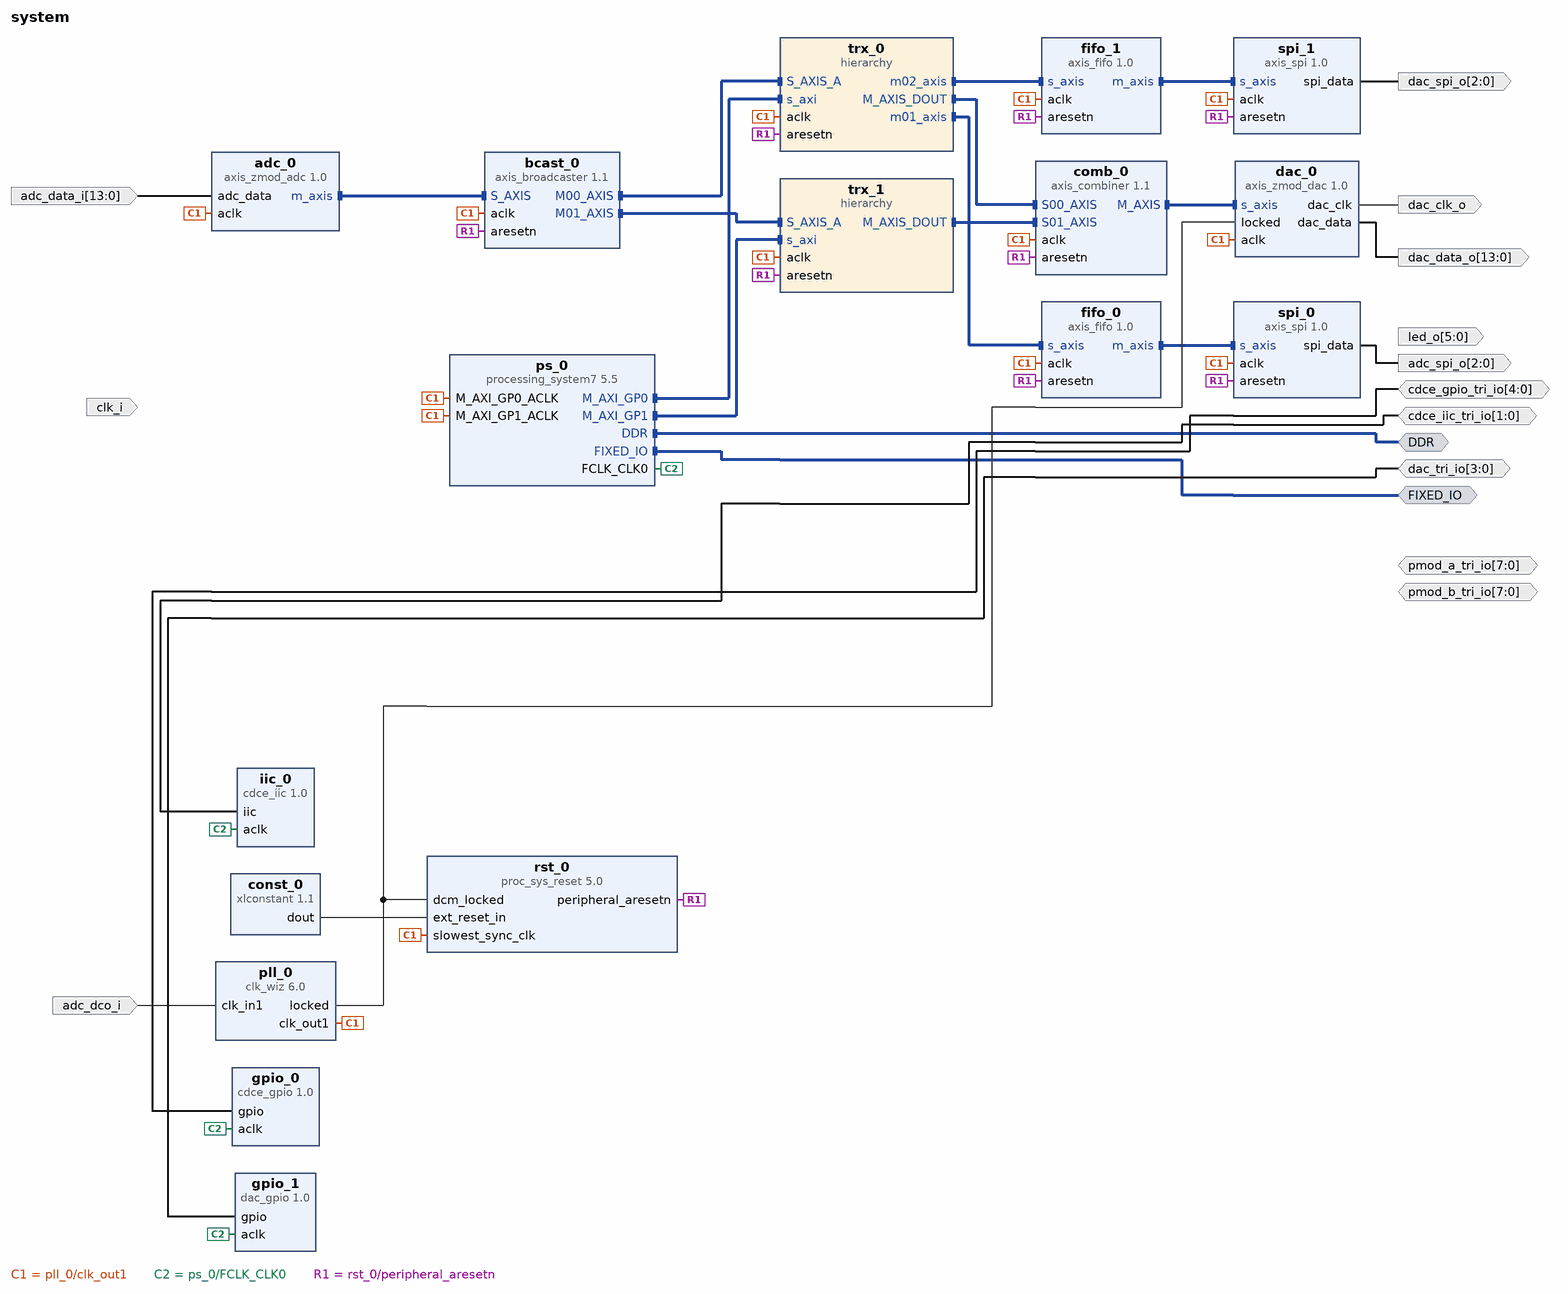
[diagram p0: block diagram of the top level]
# Vivado block design system, xc7z020clg484-1, Vivado 2024.2
create_bd_design system

create_bd_intf_port -mode Master -vlnv xilinx.com:interface:ddrx_rtl:1.0 DDR
create_bd_intf_port -mode Master -vlnv xilinx.com:display_processing_system7:fixedio_rtl:1.0 FIXED_IO
create_bd_port -dir I clk_i
create_bd_port -dir O -from 5 -to 0 led_o
create_bd_port -dir IO -from 7 -to 0 pmod_a_tri_io
create_bd_port -dir IO -from 7 -to 0 pmod_b_tri_io
create_bd_port -dir I -from 13 -to 0 adc_data_i
create_bd_port -dir I adc_dco_i
create_bd_port -dir O -from 2 -to 0 adc_spi_o
create_bd_port -dir IO -from 4 -to 0 cdce_gpio_tri_io
create_bd_port -dir IO -from 1 -to 0 cdce_iic_tri_io
create_bd_port -dir O -from 13 -to 0 dac_data_o
create_bd_port -dir O dac_clk_o
create_bd_port -dir O -from 2 -to 0 dac_spi_o
create_bd_port -dir IO -from 3 -to 0 dac_tri_io

create_bd_cell -type ip -vlnv xilinx.com:ip:clk_wiz:6.0 pll_0
set_property -dict [list \
  CONFIG.CLKIN1_UI_JITTER 600 \
  CONFIG.CLKOUT1_REQUESTED_OUT_FREQ 122.88 \
  CONFIG.CLKOUT1_USED true \
  CONFIG.JITTER_OPTIONS PS \
  CONFIG.JITTER_SEL Min_O_Jitter \
  CONFIG.PRIMITIVE PLL \
  CONFIG.PRIM_IN_FREQ 122.88 \
  CONFIG.USE_RESET false \
] [get_bd_cells pll_0]
create_bd_cell -type ip -vlnv xilinx.com:ip:processing_system7:5.5 ps_0
set_property -dict [list \
  CONFIG.PCW_APU_PERIPHERAL_FREQMHZ 666.666666 \
  CONFIG.PCW_ENET0_ENET0_IO {MIO 16 .. 27} \
  CONFIG.PCW_ENET0_GRP_MDIO_ENABLE 1 \
  CONFIG.PCW_ENET0_GRP_MDIO_IO {MIO 52 .. 53} \
  CONFIG.PCW_ENET0_PERIPHERAL_ENABLE 1 \
  CONFIG.PCW_ENET0_RESET_ENABLE 1 \
  CONFIG.PCW_ENET0_RESET_IO {MIO 9} \
  CONFIG.PCW_ENET_RESET_ENABLE 1 \
  CONFIG.PCW_ENET_RESET_SELECT {Share reset pin} \
  CONFIG.PCW_FPGA0_PERIPHERAL_FREQMHZ 100 \
  CONFIG.PCW_FPGA1_PERIPHERAL_FREQMHZ 50 \
  CONFIG.PCW_GPIO_EMIO_GPIO_ENABLE 1 \
  CONFIG.PCW_GPIO_EMIO_GPIO_IO 64 \
  CONFIG.PCW_GPIO_MIO_GPIO_ENABLE 1 \
  CONFIG.PCW_GPIO_MIO_GPIO_IO MIO \
  CONFIG.PCW_GPIO_PERIPHERAL_ENABLE 1 \
  CONFIG.PCW_I2C0_I2C0_IO EMIO \
  CONFIG.PCW_I2C0_PERIPHERAL_ENABLE 1 \
  CONFIG.PCW_I2C1_I2C1_IO {MIO 12 .. 13} \
  CONFIG.PCW_I2C1_PERIPHERAL_ENABLE 1 \
  CONFIG.PCW_I2C_PERIPHERAL_FREQMHZ 111.111115 \
  CONFIG.PCW_I2C_RESET_ENABLE 1 \
  CONFIG.PCW_I2C_RESET_SELECT {Share reset pin} \
  CONFIG.PCW_IMPORT_BOARD_PRESET cfg/eclypse_z7.xml \
  CONFIG.PCW_PRESET_BANK1_VOLTAGE {LVCMOS 1.8V} \
  CONFIG.PCW_QSPI_GRP_FBCLK_ENABLE 1 \
  CONFIG.PCW_QSPI_GRP_FBCLK_IO {MIO 8} \
  CONFIG.PCW_QSPI_GRP_SINGLE_SS_ENABLE 1 \
  CONFIG.PCW_QSPI_GRP_SINGLE_SS_IO {MIO 1 .. 6} \
  CONFIG.PCW_QSPI_PERIPHERAL_ENABLE 1 \
  CONFIG.PCW_QSPI_QSPI_IO {MIO 1 .. 6} \
  CONFIG.PCW_SD0_GRP_CD_ENABLE 1 \
  CONFIG.PCW_SD0_GRP_CD_IO {MIO 47} \
  CONFIG.PCW_SD0_GRP_WP_ENABLE 0 \
  CONFIG.PCW_SD0_PERIPHERAL_ENABLE 1 \
  CONFIG.PCW_SD0_SD0_IO {MIO 40 .. 45} \
  CONFIG.PCW_SDIO_PERIPHERAL_FREQMHZ 50 \
  CONFIG.PCW_SINGLE_QSPI_DATA_MODE x4 \
  CONFIG.PCW_UART0_PERIPHERAL_ENABLE 1 \
  CONFIG.PCW_UART0_UART0_IO {MIO 14 .. 15} \
  CONFIG.PCW_UART1_PERIPHERAL_ENABLE 0 \
  CONFIG.PCW_UART_PERIPHERAL_FREQMHZ 100 \
  CONFIG.PCW_UIPARAM_DDR_FREQ_MHZ 533.333333 \
  CONFIG.PCW_UIPARAM_DDR_MEMORY_TYPE {DDR 3 (Low Voltage)} \
  CONFIG.PCW_UIPARAM_DDR_PARTNO {MT41K256M16 RE-125} \
  CONFIG.PCW_USB0_PERIPHERAL_ENABLE 1 \
  CONFIG.PCW_USB0_RESET_ENABLE 1 \
  CONFIG.PCW_USB0_RESET_IO {MIO 46} \
  CONFIG.PCW_USB0_USB0_IO {MIO 28 .. 39} \
  CONFIG.PCW_USB_RESET_ENABLE 1 \
  CONFIG.PCW_USB_RESET_SELECT {Share reset pin} \
  CONFIG.PCW_USE_M_AXI_GP1 1 \
] [get_bd_cells ps_0]
# 426 more settings of ps_0 are not shown: defaults, MIO pin electricals, DDR timing, and values the tool derives
create_bd_cell -type ip -vlnv pavel-demin:user:cdce_iic:1.0 iic_0
set_property -dict {CONFIG.DATA_FILE cdce_122_88.mem CONFIG.DATA_SIZE 132} [get_bd_cells iic_0]
create_bd_cell -type ip -vlnv pavel-demin:user:cdce_gpio:1.0 gpio_0
create_bd_cell -type ip -vlnv pavel-demin:user:dac_gpio:1.0 gpio_1
create_bd_cell -type ip -vlnv xilinx.com:ip:xlconstant:1.1 const_0
create_bd_cell -type ip -vlnv xilinx.com:ip:proc_sys_reset:5.0 rst_0
create_bd_cell -type ip -vlnv pavel-demin:user:axis_zmod_adc:1.0 adc_0
set_property -dict {CONFIG.ADC_DATA_WIDTH 14} [get_bd_cells adc_0]
create_bd_cell -type ip -vlnv xilinx.com:ip:axis_broadcaster:1.1 bcast_0
set_property -dict [list \
  CONFIG.HAS_TKEEP 0 \
  CONFIG.HAS_TLAST 0 \
  CONFIG.HAS_TREADY 0 \
  CONFIG.HAS_TSTRB 0 \
  CONFIG.M00_TDATA_REMAP {tdata[15:0]} \
  CONFIG.M01_TDATA_REMAP {tdata[31:16]} \
  CONFIG.M_TDATA_NUM_BYTES 2 \
  CONFIG.M_TUSER_WIDTH 0 \
  CONFIG.S_TDATA_NUM_BYTES 4 \
  CONFIG.S_TUSER_WIDTH 0 \
  CONFIG.TDEST_WIDTH 0 \
  CONFIG.TID_WIDTH 0 \
] [get_bd_cells bcast_0]
create_bd_cell -type ip -vlnv xilinx.com:ip:axis_combiner:1.1 comb_0
set_property -dict {CONFIG.TDATA_NUM_BYTES 2} [get_bd_cells comb_0]
create_bd_cell -type ip -vlnv pavel-demin:user:axis_zmod_dac:1.0 dac_0
set_property -dict {CONFIG.DAC_DATA_WIDTH 14} [get_bd_cells dac_0]
create_bd_cell -type hier trx_0
create_bd_cell -type hier trx_1
create_bd_cell -type ip -vlnv pavel-demin:user:axis_fifo:1.0 fifo_0
set_property -dict {CONFIG.M_AXIS_TDATA_WIDTH 32 CONFIG.S_AXIS_TDATA_WIDTH 32 CONFIG.WRITE_DEPTH 1024} [get_bd_cells fifo_0]
create_bd_cell -type ip -vlnv pavel-demin:user:axis_spi:1.0 spi_0
set_property -dict {CONFIG.SPI_DATA_WIDTH 24} [get_bd_cells spi_0]
create_bd_cell -type ip -vlnv pavel-demin:user:axis_fifo:1.0 fifo_1
set_property -dict {CONFIG.M_AXIS_TDATA_WIDTH 32 CONFIG.S_AXIS_TDATA_WIDTH 32 CONFIG.WRITE_DEPTH 1024} [get_bd_cells fifo_1]
create_bd_cell -type ip -vlnv pavel-demin:user:axis_spi:1.0 spi_1
set_property -dict {CONFIG.SPI_DATA_WIDTH 16} [get_bd_cells spi_1]

# ---- hierarchy /trx_0 ----
current_bd_instance /trx_0
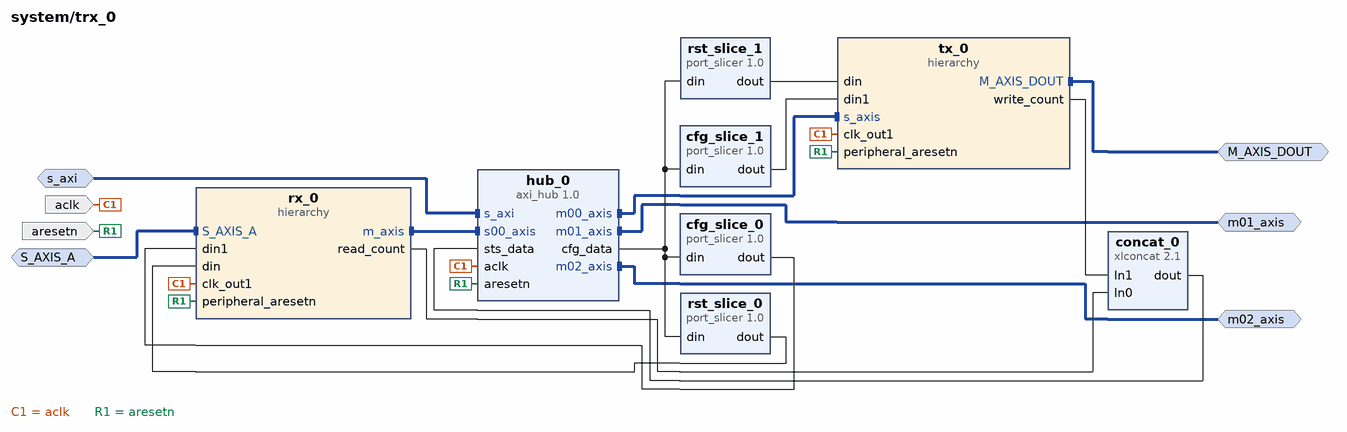
[diagram p1: block diagram inside /trx_0]
create_bd_intf_pin -mode Slave -vlnv xilinx.com:interface:aximm_rtl:1.0 s_axi
create_bd_intf_pin -mode Slave -vlnv xilinx.com:interface:axis_rtl:1.0 S_AXIS_A
create_bd_intf_pin -mode Master -vlnv xilinx.com:interface:axis_rtl:1.0 M_AXIS_DOUT
create_bd_intf_pin -mode Master -vlnv xilinx.com:interface:axis_rtl:1.0 m01_axis
create_bd_intf_pin -mode Master -vlnv xilinx.com:interface:axis_rtl:1.0 m02_axis
create_bd_pin -dir I -type clk aclk
create_bd_pin -dir I -type rst aresetn

create_bd_cell -type ip -vlnv pavel-demin:user:axi_hub:1.0 hub_0
set_property -dict {CONFIG.CFG_DATA_WIDTH 160 CONFIG.STS_DATA_WIDTH 32} [get_bd_cells hub_0]
create_bd_cell -type ip -vlnv pavel-demin:user:port_slicer:1.0 rst_slice_0
set_property -dict {CONFIG.DIN_FROM 7 CONFIG.DIN_TO 0 CONFIG.DIN_WIDTH 160} [get_bd_cells rst_slice_0]
create_bd_cell -type ip -vlnv pavel-demin:user:port_slicer:1.0 rst_slice_1
set_property -dict {CONFIG.DIN_FROM 15 CONFIG.DIN_TO 8 CONFIG.DIN_WIDTH 160} [get_bd_cells rst_slice_1]
create_bd_cell -type ip -vlnv pavel-demin:user:port_slicer:1.0 cfg_slice_0
set_property -dict {CONFIG.DIN_FROM 95 CONFIG.DIN_TO 32 CONFIG.DIN_WIDTH 160} [get_bd_cells cfg_slice_0]
create_bd_cell -type ip -vlnv pavel-demin:user:port_slicer:1.0 cfg_slice_1
set_property -dict {CONFIG.DIN_FROM 159 CONFIG.DIN_TO 96 CONFIG.DIN_WIDTH 160} [get_bd_cells cfg_slice_1]
create_bd_cell -type hier rx_0
create_bd_cell -type hier tx_0
create_bd_cell -type ip -vlnv xilinx.com:ip:xlconcat:2.1 concat_0
set_property -dict {CONFIG.IN0_WIDTH 16 CONFIG.IN1_WIDTH 16 CONFIG.NUM_PORTS 2} [get_bd_cells concat_0]

# ---- hierarchy /trx_0/rx_0 ----
current_bd_instance /trx_0/rx_0
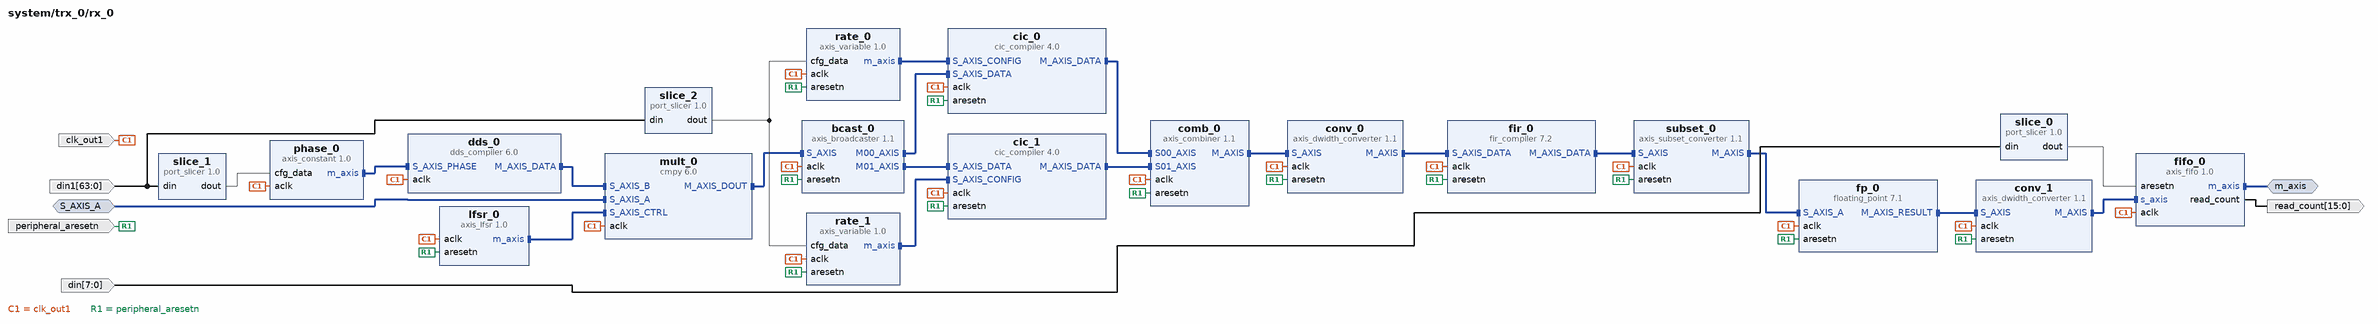
[diagram p2: block diagram inside /trx_0/rx_0]
create_bd_intf_pin -mode Master -vlnv xilinx.com:interface:axis_rtl:1.0 m_axis
create_bd_intf_pin -mode Slave -vlnv xilinx.com:interface:axis_rtl:1.0 S_AXIS_A
create_bd_pin -dir I -type clk clk_out1
create_bd_pin -dir I -type rst peripheral_aresetn
create_bd_pin -dir I -from 7 -to 0 din
create_bd_pin -dir I -from 63 -to 0 din1
create_bd_pin -dir O -from 15 -to 0 read_count

create_bd_cell -type ip -vlnv pavel-demin:user:port_slicer:1.0 slice_0
set_property -dict {CONFIG.DIN_FROM 0 CONFIG.DIN_TO 0 CONFIG.DIN_WIDTH 8} [get_bd_cells slice_0]
create_bd_cell -type ip -vlnv pavel-demin:user:port_slicer:1.0 slice_1
set_property -dict {CONFIG.DIN_FROM 39 CONFIG.DIN_TO 0 CONFIG.DIN_WIDTH 64} [get_bd_cells slice_1]
create_bd_cell -type ip -vlnv pavel-demin:user:port_slicer:1.0 slice_2
set_property -dict {CONFIG.DIN_FROM 63 CONFIG.DIN_TO 48 CONFIG.DIN_WIDTH 64} [get_bd_cells slice_2]
create_bd_cell -type ip -vlnv pavel-demin:user:axis_constant:1.0 phase_0
set_property -dict {CONFIG.AXIS_TDATA_WIDTH 40} [get_bd_cells phase_0]
create_bd_cell -type ip -vlnv xilinx.com:ip:dds_compiler:6.0 dds_0
set_property -dict [list \
  CONFIG.DDS_Clock_Rate 122.88 \
  CONFIG.DSP48_Use Minimal \
  CONFIG.Frequency_Resolution 0.2 \
  CONFIG.Has_Phase_Out false \
  CONFIG.Negative_Sine true \
  CONFIG.Output_Width 24 \
  CONFIG.Phase_Increment Streaming \
  CONFIG.Phase_Width 30 \
  CONFIG.Resync true \
  CONFIG.Spurious_Free_Dynamic_Range 138 \
] [get_bd_cells dds_0]
create_bd_cell -type ip -vlnv pavel-demin:user:axis_lfsr:1.0 lfsr_0
create_bd_cell -type ip -vlnv xilinx.com:ip:cmpy:6.0 mult_0
set_property -dict [list \
  CONFIG.APortWidth 14 \
  CONFIG.BPortWidth 24 \
  CONFIG.OutputWidth 26 \
  CONFIG.RoundMode Random_Rounding \
] [get_bd_cells mult_0]
create_bd_cell -type ip -vlnv xilinx.com:ip:axis_broadcaster:1.1 bcast_0
set_property -dict [list \
  CONFIG.HAS_TKEEP 0 \
  CONFIG.HAS_TLAST 0 \
  CONFIG.HAS_TREADY 0 \
  CONFIG.HAS_TSTRB 0 \
  CONFIG.M00_TDATA_REMAP {tdata[23:0]} \
  CONFIG.M01_TDATA_REMAP {tdata[55:32]} \
  CONFIG.M_TDATA_NUM_BYTES 3 \
  CONFIG.M_TUSER_WIDTH 0 \
  CONFIG.S_TDATA_NUM_BYTES 8 \
  CONFIG.S_TUSER_WIDTH 0 \
  CONFIG.TDEST_WIDTH 0 \
  CONFIG.TID_WIDTH 0 \
] [get_bd_cells bcast_0]
create_bd_cell -type ip -vlnv pavel-demin:user:axis_variable:1.0 rate_0
set_property -dict {CONFIG.AXIS_TDATA_WIDTH 16} [get_bd_cells rate_0]
create_bd_cell -type ip -vlnv pavel-demin:user:axis_variable:1.0 rate_1
set_property -dict {CONFIG.AXIS_TDATA_WIDTH 16} [get_bd_cells rate_1]
create_bd_cell -type ip -vlnv xilinx.com:ip:cic_compiler:4.0 cic_0
set_property -dict [list \
  CONFIG.Clock_Frequency 122.88 \
  CONFIG.Filter_Type Decimation \
  CONFIG.Fixed_Or_Initial_Rate 640 \
  CONFIG.HAS_ARESETN true \
  CONFIG.Input_Data_Width 24 \
  CONFIG.Input_Sample_Frequency 122.88 \
  CONFIG.Maximum_Rate 8192 \
  CONFIG.Minimum_Rate 40 \
  CONFIG.Number_Of_Stages 6 \
  CONFIG.Output_Data_Width 32 \
  CONFIG.Quantization Truncation \
  CONFIG.Sample_Rate_Changes Programmable \
  CONFIG.Use_Xtreme_DSP_Slice false \
] [get_bd_cells cic_0]
create_bd_cell -type ip -vlnv xilinx.com:ip:cic_compiler:4.0 cic_1
set_property -dict [list \
  CONFIG.Clock_Frequency 122.88 \
  CONFIG.Filter_Type Decimation \
  CONFIG.Fixed_Or_Initial_Rate 640 \
  CONFIG.HAS_ARESETN true \
  CONFIG.Input_Data_Width 24 \
  CONFIG.Input_Sample_Frequency 122.88 \
  CONFIG.Maximum_Rate 8192 \
  CONFIG.Minimum_Rate 40 \
  CONFIG.Number_Of_Stages 6 \
  CONFIG.Output_Data_Width 32 \
  CONFIG.Quantization Truncation \
  CONFIG.Sample_Rate_Changes Programmable \
  CONFIG.Use_Xtreme_DSP_Slice false \
] [get_bd_cells cic_1]
create_bd_cell -type ip -vlnv xilinx.com:ip:axis_combiner:1.1 comb_0
set_property -dict {CONFIG.TDATA_NUM_BYTES 4} [get_bd_cells comb_0]
create_bd_cell -type ip -vlnv xilinx.com:ip:axis_dwidth_converter:1.1 conv_0
set_property -dict {CONFIG.M_TDATA_NUM_BYTES 4 CONFIG.S_TDATA_NUM_BYTES 8} [get_bd_cells conv_0]
create_bd_cell -type ip -vlnv xilinx.com:ip:fir_compiler:7.2 fir_0
set_property -dict [list \
  CONFIG.BestPrecision true \
  CONFIG.Clock_Frequency 122.88 \
  CONFIG.CoefficientVector {['-1.6474608535e-08, -4.7302195930e-08, -7.8619468076e-10, 3.0921189871e-08, 1.8608837232e-08, 3.2734022251e-08, -6.2813438189e-09, -1.5221363991e-07, -8.3032953559e-08, 3.1439829734e-07,', '3.0552900504e-07, -4.7396324870e-07, -7.1323740619e-07, 5.4707476786e-07, 1.3341171590e-06, -4.1393271599e-07, -2.1496782582e-06, -6.7769353338e-08, 3.0742601185e-06, 1.0366765715e-06,', '-3.9428070248e-06, -2.5909585490e-06, 4.5135845246e-06, 4.7460225319e-06, -4.4910558070e-06, -7.3953978786e-06, 3.5707408445e-06, 1.0285546038e-05, -1.5032224453e-06, -1.3015815434e-05,', '-1.8313444384e-06, 1.5072320650e-05, 6.3521132941e-06, -1.5899576427e-05, -1.1727813184e-05, 1.5005323291e-05, 1.7365093303e-05, -1.2089910213e-05, -2.2458022005e-05, 7.1673633916e-06,', '2.6093058018e-05, -6.6389116544e-07, -2.7418691729e-05, -6.5473442360e-06, 2.5854600003e-05, 1.3198330110e-05, -2.1309361735e-05, -1.7782206252e-05, 1.4361810624e-05, 1.8811515648e-05,', '-6.3566406461e-06, -1.5155979368e-05, -6.3247080943e-07, 6.4130448230e-06, 4.0040582068e-06, 6.7546397959e-06, -1.0026074055e-06, -2.2393312940e-05, -1.0760842920e-05, 3.7217184434e-05,', '3.2690283793e-05, -4.6839875203e-05, -6.4629245773e-05, 4.6239001154e-05, 1.0436232686e-04, -3.0525157948e-05, -1.4740012610e-04, -4.1219698477e-06, 1.8711256488e-04, 5.9452347683e-05,', '-2.1528991520e-04, -1.3425249804e-04, 2.2313567651e-04, 2.2375017156e-04, -2.0262013024e-04, -3.1950057315e-04, 1.4803738125e-04, 4.0989148374e-04, -5.7537086900e-05, -4.8132818219e-04,', '-6.5649818729e-05, 5.2004965910e-04, 2.1257912313e-04, -5.1442095551e-04, -3.6885882761e-04, 4.5729416912e-04, 5.1576895071e-04, -3.4835026230e-04, -6.3263165645e-04, 1.9558527632e-04,', '6.9991497630e-04, -1.5808526144e-05, -7.0293422773e-04, -1.6629328762e-04, 6.3560456533e-04, 3.2068673279e-04, -5.0363032844e-04, -4.1607263761e-04, 3.2646656336e-04, 4.2520826054e-04,', '-1.3744582074e-04, -3.3090412765e-04, -1.8384678041e-05, 1.3189799213e-04, 8.8910161182e-05, 1.5233898500e-04, -2.1947620222e-05, -4.7890099404e-04, -2.2611987722e-04, 7.8125561143e-04,', '6.8011510442e-04, -9.7341268920e-04, -1.3369440637e-03, 9.5707198274e-04, 2.1574180007e-03, -6.3274475096e-04, -3.0612079709e-03, -8.6312096489e-05, 3.9259517547e-03, 1.2584739205e-03,', '-4.5913883984e-03, -2.8979884036e-03, 4.8688805659e-03, 4.9608225128e-03, -4.5560763256e-03, -7.3338396684e-03, 3.4557999231e-03, 9.8287225977e-03, -1.3976559014e-03, -1.2181437284e-02,', '-1.7396234513e-03, 1.4056850557e-02, 6.0061144608e-03, -1.5059808596e-02, -1.1365595088e-02, 1.4742813384e-02, 1.7680205017e-02, -1.2613964567e-02, -2.4703438754e-02, 8.1283099644e-03,', '3.2073997143e-02, -6.4577008839e-04, -3.9302054798e-02, -1.0686996220e-02, 4.5719765638e-02, 2.7237877738e-02, -5.0304069016e-02, -5.1693673194e-02, 5.1004633533e-02, 9.0534093654e-02,', '-4.1604028747e-02, -1.6368908068e-01, -1.0763878172e-02, 3.5633171189e-01, 5.5470627800e-01, 3.5633171189e-01, -1.0763878172e-02, -1.6368908068e-01, -4.1604028747e-02, 9.0534093654e-02,', '5.1004633533e-02, -5.1693673194e-02, -5.0304069016e-02, 2.7237877738e-02, 4.5719765638e-02, -1.0686996220e-02, -3.9302054798e-02, -6.4577008839e-04, 3.2073997143e-02, 8.1283099644e-03,', '-2.4703438754e-02, -1.2613964567e-02, 1.7680205017e-02, 1.4742813384e-02, -1.1365595088e-02, -1.5059808596e-02, 6.0061144608e-03, 1.4056850557e-02, -1.7396234513e-03, -1.2181437284e-02,', '-1.3976559014e-03, 9.8287225977e-03, 3.4557999231e-03, -7.3338396684e-03, -4.5560763256e-03, 4.9608225128e-03, 4.8688805659e-03, -2.8979884036e-03, -4.5913883984e-03, 1.2584739205e-03,', '3.9259517547e-03, -8.6312096489e-05, -3.0612079709e-03, -6.3274475096e-04, 2.1574180007e-03, 9.5707198274e-04, -1.3369440637e-03, -9.7341268920e-04, 6.8011510442e-04, 7.8125561143e-04,', '-2.2611987722e-04, -4.7890099404e-04, -2.1947620222e-05, 1.5233898500e-04, 8.8910161182e-05, 1.3189799213e-04, -1.8384678041e-05, -3.3090412765e-04, -1.3744582074e-04, 4.2520826054e-04,', '3.2646656336e-04, -4.1607263761e-04, -5.0363032844e-04, 3.2068673279e-04, 6.3560456533e-04, -1.6629328762e-04, -7.0293422773e-04, -1.5808526144e-05, 6.9991497630e-04, 1.9558527632e-04,', '-6.3263165645e-04, -3.4835026230e-04, 5.1576895071e-04, 4.5729416912e-04, -3.6885882761e-04, -5.1442095551e-04, 2.1257912313e-04, 5.2004965910e-04, -6.5649818729e-05, -4.8132818219e-04,', '-5.7537086900e-05, 4.0989148374e-04, 1.4803738125e-04, -3.1950057315e-04, -2.0262013024e-04, 2.2375017156e-04, 2.2313567651e-04, -1.3425249804e-04, -2.1528991520e-04, 5.9452347683e-05,', '1.8711256488e-04, -4.1219698477e-06, -1.4740012610e-04, -3.0525157948e-05, 1.0436232686e-04, 4.6239001154e-05, -6.4629245773e-05, -4.6839875203e-05, 3.2690283793e-05, 3.7217184434e-05,', '-1.0760842920e-05, -2.2393312940e-05, -1.0026074055e-06, 6.7546397959e-06, 4.0040582068e-06, 6.4130448230e-06, -6.3247080943e-07, -1.5155979368e-05, -6.3566406461e-06, 1.8811515648e-05,', '1.4361810624e-05, -1.7782206252e-05, -2.1309361735e-05, 1.3198330110e-05, 2.5854600003e-05, -6.5473442360e-06, -2.7418691729e-05, -6.6389116544e-07, 2.6093058018e-05, 7.1673633916e-06,', '-2.2458022005e-05, -1.2089910213e-05, 1.7365093303e-05, 1.5005323291e-05, -1.1727813184e-05, -1.5899576427e-05, 6.3521132941e-06, 1.5072320650e-05, -1.8313444384e-06, -1.3015815434e-05,', '-1.5032224453e-06, 1.0285546038e-05, 3.5707408445e-06, -7.3953978786e-06, -4.4910558070e-06, 4.7460225319e-06, 4.5135845246e-06, -2.5909585490e-06, -3.9428070248e-06, 1.0366765715e-06,', '3.0742601185e-06, -6.7769353338e-08, -2.1496782582e-06, -4.1393271599e-07, 1.3341171590e-06, 5.4707476786e-07, -7.1323740619e-07, -4.7396324870e-07, 3.0552900504e-07, 3.1439829734e-07,', '-8.3032953559e-08, -1.5221363991e-07, -6.2813438189e-09, 3.2734022251e-08, 1.8608837232e-08, 3.0921189871e-08, -7.8619468076e-10, -4.7302195930e-08, -1.6474608535e-08']} \
  CONFIG.Coefficient_Width 24 \
  CONFIG.Data_Width 32 \
  CONFIG.Decimation_Rate 2 \
  CONFIG.Filter_Type Decimation \
  CONFIG.Has_ARESETn true \
  CONFIG.Number_Channels 2 \
  CONFIG.Number_Paths 1 \
  CONFIG.Output_Rounding_Mode Convergent_Rounding_to_Even \
  CONFIG.Output_Width 25 \
  CONFIG.Quantization Quantize_Only \
  CONFIG.Sample_Frequency 3.072 \
] [get_bd_cells fir_0]
create_bd_cell -type ip -vlnv xilinx.com:ip:axis_subset_converter:1.1 subset_0
set_property -dict [list \
  CONFIG.M_HAS_TKEEP 0 \
  CONFIG.M_HAS_TLAST 0 \
  CONFIG.M_HAS_TREADY 0 \
  CONFIG.M_HAS_TSTRB 0 \
  CONFIG.M_TDATA_NUM_BYTES 3 \
  CONFIG.M_TDEST_WIDTH 0 \
  CONFIG.M_TID_WIDTH 0 \
  CONFIG.M_TUSER_WIDTH 0 \
  CONFIG.S_HAS_TKEEP 0 \
  CONFIG.S_HAS_TLAST 0 \
  CONFIG.S_HAS_TREADY 0 \
  CONFIG.S_HAS_TSTRB 0 \
  CONFIG.S_TDATA_NUM_BYTES 4 \
  CONFIG.S_TDEST_WIDTH 0 \
  CONFIG.S_TID_WIDTH 0 \
  CONFIG.S_TUSER_WIDTH 0 \
  CONFIG.TDATA_REMAP {tdata[23:0]} \
] [get_bd_cells subset_0]
create_bd_cell -type ip -vlnv xilinx.com:ip:floating_point:7.1 fp_0
set_property -dict [list \
  CONFIG.A_Precision_Type Custom \
  CONFIG.C_A_Exponent_Width 2 \
  CONFIG.C_A_Fraction_Width 22 \
  CONFIG.Has_ARESETn true \
  CONFIG.Operation_Type Fixed_to_float \
  CONFIG.Result_Precision_Type Single \
] [get_bd_cells fp_0]
create_bd_cell -type ip -vlnv xilinx.com:ip:axis_dwidth_converter:1.1 conv_1
set_property -dict {CONFIG.M_TDATA_NUM_BYTES 8 CONFIG.S_TDATA_NUM_BYTES 4} [get_bd_cells conv_1]
create_bd_cell -type ip -vlnv pavel-demin:user:axis_fifo:1.0 fifo_0
set_property -dict [list \
  CONFIG.ALWAYS_READY TRUE \
  CONFIG.M_AXIS_TDATA_WIDTH 32 \
  CONFIG.S_AXIS_TDATA_WIDTH 64 \
  CONFIG.WRITE_DEPTH 4096 \
] [get_bd_cells fifo_0]

# ---- hierarchy /trx_0/tx_0 ----
current_bd_instance /trx_0/tx_0
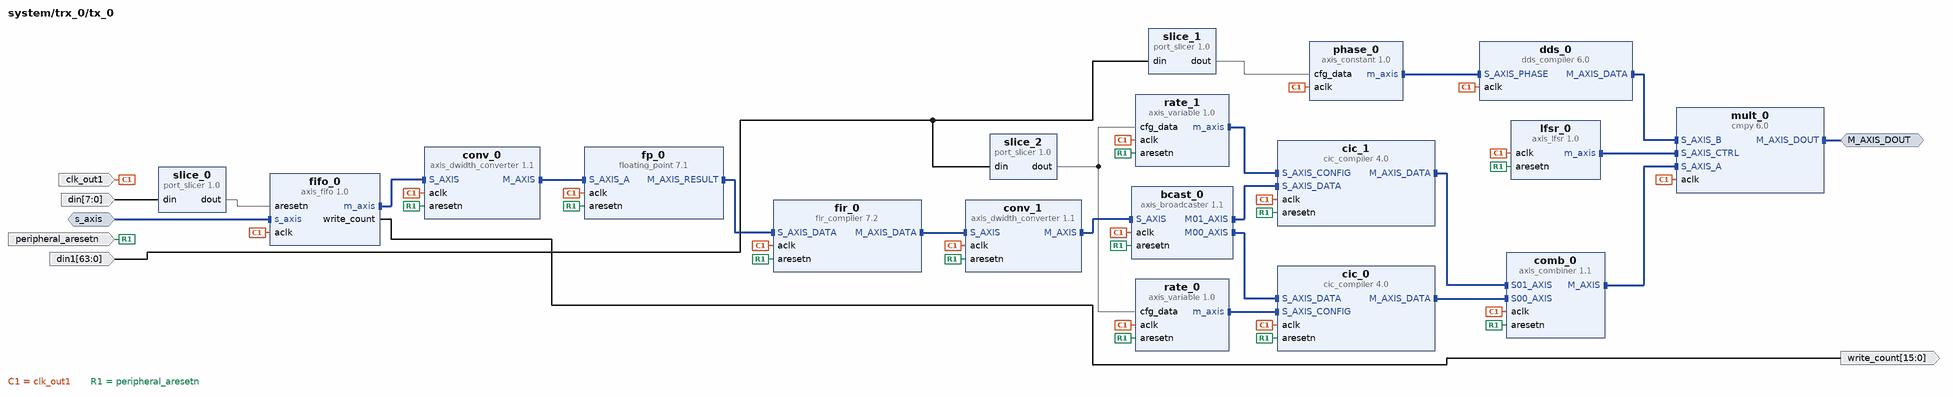
[diagram p3: block diagram inside /trx_0/tx_0]
create_bd_intf_pin -mode Slave -vlnv xilinx.com:interface:axis_rtl:1.0 s_axis
create_bd_intf_pin -mode Master -vlnv xilinx.com:interface:axis_rtl:1.0 M_AXIS_DOUT
create_bd_pin -dir I -type clk clk_out1
create_bd_pin -dir I -type rst peripheral_aresetn
create_bd_pin -dir I -from 7 -to 0 din
create_bd_pin -dir I -from 63 -to 0 din1
create_bd_pin -dir O -from 15 -to 0 write_count

create_bd_cell -type ip -vlnv pavel-demin:user:port_slicer:1.0 slice_0
set_property -dict {CONFIG.DIN_FROM 0 CONFIG.DIN_TO 0 CONFIG.DIN_WIDTH 8} [get_bd_cells slice_0]
create_bd_cell -type ip -vlnv pavel-demin:user:port_slicer:1.0 slice_1
set_property -dict {CONFIG.DIN_FROM 39 CONFIG.DIN_TO 0 CONFIG.DIN_WIDTH 64} [get_bd_cells slice_1]
create_bd_cell -type ip -vlnv pavel-demin:user:port_slicer:1.0 slice_2
set_property -dict {CONFIG.DIN_FROM 63 CONFIG.DIN_TO 48 CONFIG.DIN_WIDTH 64} [get_bd_cells slice_2]
create_bd_cell -type ip -vlnv pavel-demin:user:axis_fifo:1.0 fifo_0
set_property -dict [list \
  CONFIG.ALWAYS_VALID TRUE \
  CONFIG.M_AXIS_TDATA_WIDTH 64 \
  CONFIG.S_AXIS_TDATA_WIDTH 32 \
  CONFIG.WRITE_DEPTH 8192 \
] [get_bd_cells fifo_0]
create_bd_cell -type ip -vlnv xilinx.com:ip:axis_dwidth_converter:1.1 conv_0
set_property -dict {CONFIG.M_TDATA_NUM_BYTES 4 CONFIG.S_TDATA_NUM_BYTES 8} [get_bd_cells conv_0]
create_bd_cell -type ip -vlnv xilinx.com:ip:floating_point:7.1 fp_0
set_property -dict [list \
  CONFIG.C_Result_Exponent_Width 2 \
  CONFIG.C_Result_Fraction_Width 22 \
  CONFIG.Has_ARESETn true \
  CONFIG.Operation_Type Float_to_fixed \
  CONFIG.Result_Precision_Type Custom \
] [get_bd_cells fp_0]
create_bd_cell -type ip -vlnv xilinx.com:ip:fir_compiler:7.2 fir_0
set_property -dict [list \
  CONFIG.BestPrecision true \
  CONFIG.Clock_Frequency 122.88 \
  CONFIG.CoefficientVector {['-1.6474608535e-08, -4.7302195930e-08, -7.8619468076e-10, 3.0921189871e-08, 1.8608837232e-08, 3.2734022251e-08, -6.2813438189e-09, -1.5221363991e-07, -8.3032953559e-08, 3.1439829734e-07,', '3.0552900504e-07, -4.7396324870e-07, -7.1323740619e-07, 5.4707476786e-07, 1.3341171590e-06, -4.1393271599e-07, -2.1496782582e-06, -6.7769353338e-08, 3.0742601185e-06, 1.0366765715e-06,', '-3.9428070248e-06, -2.5909585490e-06, 4.5135845246e-06, 4.7460225319e-06, -4.4910558070e-06, -7.3953978786e-06, 3.5707408445e-06, 1.0285546038e-05, -1.5032224453e-06, -1.3015815434e-05,', '-1.8313444384e-06, 1.5072320650e-05, 6.3521132941e-06, -1.5899576427e-05, -1.1727813184e-05, 1.5005323291e-05, 1.7365093303e-05, -1.2089910213e-05, -2.2458022005e-05, 7.1673633916e-06,', '2.6093058018e-05, -6.6389116544e-07, -2.7418691729e-05, -6.5473442360e-06, 2.5854600003e-05, 1.3198330110e-05, -2.1309361735e-05, -1.7782206252e-05, 1.4361810624e-05, 1.8811515648e-05,', '-6.3566406461e-06, -1.5155979368e-05, -6.3247080943e-07, 6.4130448230e-06, 4.0040582068e-06, 6.7546397959e-06, -1.0026074055e-06, -2.2393312940e-05, -1.0760842920e-05, 3.7217184434e-05,', '3.2690283793e-05, -4.6839875203e-05, -6.4629245773e-05, 4.6239001154e-05, 1.0436232686e-04, -3.0525157948e-05, -1.4740012610e-04, -4.1219698477e-06, 1.8711256488e-04, 5.9452347683e-05,', '-2.1528991520e-04, -1.3425249804e-04, 2.2313567651e-04, 2.2375017156e-04, -2.0262013024e-04, -3.1950057315e-04, 1.4803738125e-04, 4.0989148374e-04, -5.7537086900e-05, -4.8132818219e-04,', '-6.5649818729e-05, 5.2004965910e-04, 2.1257912313e-04, -5.1442095551e-04, -3.6885882761e-04, 4.5729416912e-04, 5.1576895071e-04, -3.4835026230e-04, -6.3263165645e-04, 1.9558527632e-04,', '6.9991497630e-04, -1.5808526144e-05, -7.0293422773e-04, -1.6629328762e-04, 6.3560456533e-04, 3.2068673279e-04, -5.0363032844e-04, -4.1607263761e-04, 3.2646656336e-04, 4.2520826054e-04,', '-1.3744582074e-04, -3.3090412765e-04, -1.8384678041e-05, 1.3189799213e-04, 8.8910161182e-05, 1.5233898500e-04, -2.1947620222e-05, -4.7890099404e-04, -2.2611987722e-04, 7.8125561143e-04,', '6.8011510442e-04, -9.7341268920e-04, -1.3369440637e-03, 9.5707198274e-04, 2.1574180007e-03, -6.3274475096e-04, -3.0612079709e-03, -8.6312096489e-05, 3.9259517547e-03, 1.2584739205e-03,', '-4.5913883984e-03, -2.8979884036e-03, 4.8688805659e-03, 4.9608225128e-03, -4.5560763256e-03, -7.3338396684e-03, 3.4557999231e-03, 9.8287225977e-03, -1.3976559014e-03, -1.2181437284e-02,', '-1.7396234513e-03, 1.4056850557e-02, 6.0061144608e-03, -1.5059808596e-02, -1.1365595088e-02, 1.4742813384e-02, 1.7680205017e-02, -1.2613964567e-02, -2.4703438754e-02, 8.1283099644e-03,', '3.2073997143e-02, -6.4577008839e-04, -3.9302054798e-02, -1.0686996220e-02, 4.5719765638e-02, 2.7237877738e-02, -5.0304069016e-02, -5.1693673194e-02, 5.1004633533e-02, 9.0534093654e-02,', '-4.1604028747e-02, -1.6368908068e-01, -1.0763878172e-02, 3.5633171189e-01, 5.5470627800e-01, 3.5633171189e-01, -1.0763878172e-02, -1.6368908068e-01, -4.1604028747e-02, 9.0534093654e-02,', '5.1004633533e-02, -5.1693673194e-02, -5.0304069016e-02, 2.7237877738e-02, 4.5719765638e-02, -1.0686996220e-02, -3.9302054798e-02, -6.4577008839e-04, 3.2073997143e-02, 8.1283099644e-03,', '-2.4703438754e-02, -1.2613964567e-02, 1.7680205017e-02, 1.4742813384e-02, -1.1365595088e-02, -1.5059808596e-02, 6.0061144608e-03, 1.4056850557e-02, -1.7396234513e-03, -1.2181437284e-02,', '-1.3976559014e-03, 9.8287225977e-03, 3.4557999231e-03, -7.3338396684e-03, -4.5560763256e-03, 4.9608225128e-03, 4.8688805659e-03, -2.8979884036e-03, -4.5913883984e-03, 1.2584739205e-03,', '3.9259517547e-03, -8.6312096489e-05, -3.0612079709e-03, -6.3274475096e-04, 2.1574180007e-03, 9.5707198274e-04, -1.3369440637e-03, -9.7341268920e-04, 6.8011510442e-04, 7.8125561143e-04,', '-2.2611987722e-04, -4.7890099404e-04, -2.1947620222e-05, 1.5233898500e-04, 8.8910161182e-05, 1.3189799213e-04, -1.8384678041e-05, -3.3090412765e-04, -1.3744582074e-04, 4.2520826054e-04,', '3.2646656336e-04, -4.1607263761e-04, -5.0363032844e-04, 3.2068673279e-04, 6.3560456533e-04, -1.6629328762e-04, -7.0293422773e-04, -1.5808526144e-05, 6.9991497630e-04, 1.9558527632e-04,', '-6.3263165645e-04, -3.4835026230e-04, 5.1576895071e-04, 4.5729416912e-04, -3.6885882761e-04, -5.1442095551e-04, 2.1257912313e-04, 5.2004965910e-04, -6.5649818729e-05, -4.8132818219e-04,', '-5.7537086900e-05, 4.0989148374e-04, 1.4803738125e-04, -3.1950057315e-04, -2.0262013024e-04, 2.2375017156e-04, 2.2313567651e-04, -1.3425249804e-04, -2.1528991520e-04, 5.9452347683e-05,', '1.8711256488e-04, -4.1219698477e-06, -1.4740012610e-04, -3.0525157948e-05, 1.0436232686e-04, 4.6239001154e-05, -6.4629245773e-05, -4.6839875203e-05, 3.2690283793e-05, 3.7217184434e-05,', '-1.0760842920e-05, -2.2393312940e-05, -1.0026074055e-06, 6.7546397959e-06, 4.0040582068e-06, 6.4130448230e-06, -6.3247080943e-07, -1.5155979368e-05, -6.3566406461e-06, 1.8811515648e-05,', '1.4361810624e-05, -1.7782206252e-05, -2.1309361735e-05, 1.3198330110e-05, 2.5854600003e-05, -6.5473442360e-06, -2.7418691729e-05, -6.6389116544e-07, 2.6093058018e-05, 7.1673633916e-06,', '-2.2458022005e-05, -1.2089910213e-05, 1.7365093303e-05, 1.5005323291e-05, -1.1727813184e-05, -1.5899576427e-05, 6.3521132941e-06, 1.5072320650e-05, -1.8313444384e-06, -1.3015815434e-05,', '-1.5032224453e-06, 1.0285546038e-05, 3.5707408445e-06, -7.3953978786e-06, -4.4910558070e-06, 4.7460225319e-06, 4.5135845246e-06, -2.5909585490e-06, -3.9428070248e-06, 1.0366765715e-06,', '3.0742601185e-06, -6.7769353338e-08, -2.1496782582e-06, -4.1393271599e-07, 1.3341171590e-06, 5.4707476786e-07, -7.1323740619e-07, -4.7396324870e-07, 3.0552900504e-07, 3.1439829734e-07,', '-8.3032953559e-08, -1.5221363991e-07, -6.2813438189e-09, 3.2734022251e-08, 1.8608837232e-08, 3.0921189871e-08, -7.8619468076e-10, -4.7302195930e-08, -1.6474608535e-08']} \
  CONFIG.Coefficient_Width 24 \
  CONFIG.Data_Width 24 \
  CONFIG.Filter_Type Interpolation \
  CONFIG.Has_ARESETn true \
  CONFIG.Interpolation_Rate 2 \
  CONFIG.M_DATA_Has_TREADY true \
  CONFIG.Number_Channels 2 \
  CONFIG.Number_Paths 1 \
  CONFIG.Output_Rounding_Mode Convergent_Rounding_to_Even \
  CONFIG.Output_Width 25 \
  CONFIG.Quantization Quantize_Only \
  CONFIG.Sample_Frequency 1.536 \
] [get_bd_cells fir_0]
create_bd_cell -type ip -vlnv xilinx.com:ip:axis_dwidth_converter:1.1 conv_1
set_property -dict {CONFIG.M_TDATA_NUM_BYTES 8 CONFIG.S_TDATA_NUM_BYTES 4} [get_bd_cells conv_1]
create_bd_cell -type ip -vlnv xilinx.com:ip:axis_broadcaster:1.1 bcast_0
set_property -dict [list \
  CONFIG.HAS_TKEEP 0 \
  CONFIG.HAS_TLAST 0 \
  CONFIG.HAS_TREADY 1 \
  CONFIG.HAS_TSTRB 0 \
  CONFIG.M00_TDATA_REMAP {tdata[23:0]} \
  CONFIG.M01_TDATA_REMAP {tdata[55:32]} \
  CONFIG.M_TDATA_NUM_BYTES 3 \
  CONFIG.M_TUSER_WIDTH 0 \
  CONFIG.S_TDATA_NUM_BYTES 8 \
  CONFIG.S_TUSER_WIDTH 0 \
  CONFIG.TDEST_WIDTH 0 \
  CONFIG.TID_WIDTH 0 \
] [get_bd_cells bcast_0]
create_bd_cell -type ip -vlnv pavel-demin:user:axis_variable:1.0 rate_0
set_property -dict {CONFIG.AXIS_TDATA_WIDTH 16} [get_bd_cells rate_0]
create_bd_cell -type ip -vlnv pavel-demin:user:axis_variable:1.0 rate_1
set_property -dict {CONFIG.AXIS_TDATA_WIDTH 16} [get_bd_cells rate_1]
create_bd_cell -type ip -vlnv xilinx.com:ip:cic_compiler:4.0 cic_0
set_property -dict [list \
  CONFIG.Clock_Frequency 122.88 \
  CONFIG.Filter_Type Interpolation \
  CONFIG.Fixed_Or_Initial_Rate 640 \
  CONFIG.HAS_ARESETN true \
  CONFIG.Input_Data_Width 24 \
  CONFIG.Input_Sample_Frequency 3.072 \
  CONFIG.Maximum_Rate 8192 \
  CONFIG.Minimum_Rate 40 \
  CONFIG.Number_Of_Stages 6 \
  CONFIG.Output_Data_Width 24 \
  CONFIG.Quantization Truncation \
  CONFIG.Sample_Rate_Changes Programmable \
  CONFIG.Use_Xtreme_DSP_Slice false \
] [get_bd_cells cic_0]
create_bd_cell -type ip -vlnv xilinx.com:ip:cic_compiler:4.0 cic_1
set_property -dict [list \
  CONFIG.Clock_Frequency 122.88 \
  CONFIG.Filter_Type Interpolation \
  CONFIG.Fixed_Or_Initial_Rate 640 \
  CONFIG.HAS_ARESETN true \
  CONFIG.Input_Data_Width 24 \
  CONFIG.Input_Sample_Frequency 3.072 \
  CONFIG.Maximum_Rate 8192 \
  CONFIG.Minimum_Rate 40 \
  CONFIG.Number_Of_Stages 6 \
  CONFIG.Output_Data_Width 24 \
  CONFIG.Quantization Truncation \
  CONFIG.Sample_Rate_Changes Programmable \
  CONFIG.Use_Xtreme_DSP_Slice false \
] [get_bd_cells cic_1]
create_bd_cell -type ip -vlnv xilinx.com:ip:axis_combiner:1.1 comb_0
set_property -dict {CONFIG.TDATA_NUM_BYTES 3} [get_bd_cells comb_0]
create_bd_cell -type ip -vlnv pavel-demin:user:axis_constant:1.0 phase_0
set_property -dict {CONFIG.AXIS_TDATA_WIDTH 40} [get_bd_cells phase_0]
create_bd_cell -type ip -vlnv xilinx.com:ip:dds_compiler:6.0 dds_0
set_property -dict [list \
  CONFIG.DDS_Clock_Rate 122.88 \
  CONFIG.DSP48_Use Minimal \
  CONFIG.Frequency_Resolution 0.2 \
  CONFIG.Has_Phase_Out false \
  CONFIG.Output_Width 24 \
  CONFIG.Phase_Increment Streaming \
  CONFIG.Phase_Width 30 \
  CONFIG.Resync true \
  CONFIG.Spurious_Free_Dynamic_Range 138 \
] [get_bd_cells dds_0]
create_bd_cell -type ip -vlnv pavel-demin:user:axis_lfsr:1.0 lfsr_0
create_bd_cell -type ip -vlnv xilinx.com:ip:cmpy:6.0 mult_0
set_property -dict [list \
  CONFIG.APortWidth 24 \
  CONFIG.BPortWidth 24 \
  CONFIG.OutputWidth 17 \
  CONFIG.RoundMode Random_Rounding \
] [get_bd_cells mult_0]

# ---- hierarchy /trx_1 ----
current_bd_instance /trx_1
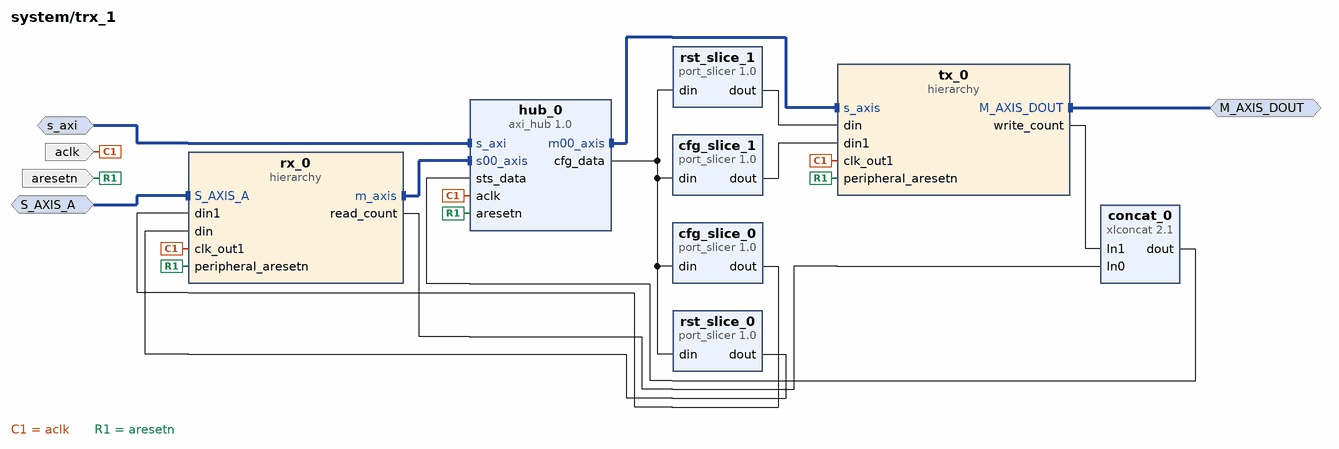
[diagram p4: block diagram inside /trx_1]
create_bd_intf_pin -mode Slave -vlnv xilinx.com:interface:aximm_rtl:1.0 s_axi
create_bd_intf_pin -mode Slave -vlnv xilinx.com:interface:axis_rtl:1.0 S_AXIS_A
create_bd_intf_pin -mode Master -vlnv xilinx.com:interface:axis_rtl:1.0 M_AXIS_DOUT
create_bd_pin -dir I -type clk aclk
create_bd_pin -dir I -type rst aresetn

create_bd_cell -type ip -vlnv pavel-demin:user:axi_hub:1.0 hub_0
set_property -dict {CONFIG.CFG_DATA_WIDTH 160 CONFIG.STS_DATA_WIDTH 32} [get_bd_cells hub_0]
create_bd_cell -type ip -vlnv pavel-demin:user:port_slicer:1.0 rst_slice_0
set_property -dict {CONFIG.DIN_FROM 7 CONFIG.DIN_TO 0 CONFIG.DIN_WIDTH 160} [get_bd_cells rst_slice_0]
create_bd_cell -type ip -vlnv pavel-demin:user:port_slicer:1.0 rst_slice_1
set_property -dict {CONFIG.DIN_FROM 15 CONFIG.DIN_TO 8 CONFIG.DIN_WIDTH 160} [get_bd_cells rst_slice_1]
create_bd_cell -type ip -vlnv pavel-demin:user:port_slicer:1.0 cfg_slice_0
set_property -dict {CONFIG.DIN_FROM 95 CONFIG.DIN_TO 32 CONFIG.DIN_WIDTH 160} [get_bd_cells cfg_slice_0]
create_bd_cell -type ip -vlnv pavel-demin:user:port_slicer:1.0 cfg_slice_1
set_property -dict {CONFIG.DIN_FROM 159 CONFIG.DIN_TO 96 CONFIG.DIN_WIDTH 160} [get_bd_cells cfg_slice_1]
create_bd_cell -type hier rx_0
create_bd_cell -type hier tx_0
create_bd_cell -type ip -vlnv xilinx.com:ip:xlconcat:2.1 concat_0
set_property -dict {CONFIG.IN0_WIDTH 16 CONFIG.IN1_WIDTH 16 CONFIG.NUM_PORTS 2} [get_bd_cells concat_0]

# ---- hierarchy /trx_1/rx_0 ----
current_bd_instance /trx_1/rx_0
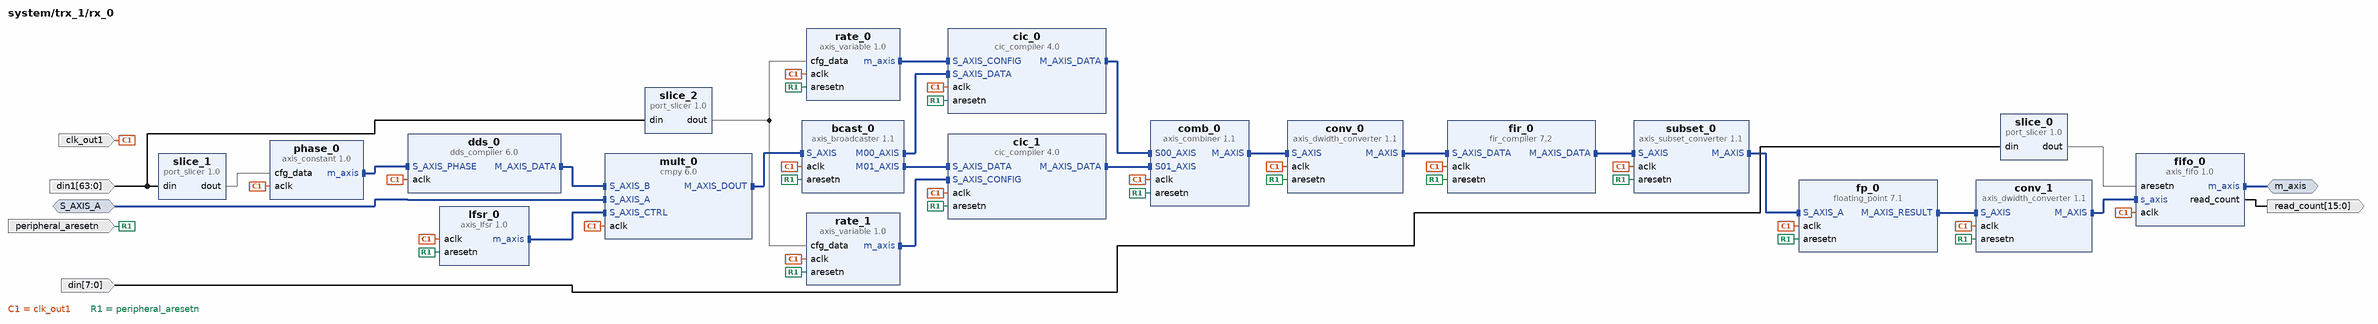
[diagram p5: block diagram inside /trx_1/rx_0]
create_bd_intf_pin -mode Master -vlnv xilinx.com:interface:axis_rtl:1.0 m_axis
create_bd_intf_pin -mode Slave -vlnv xilinx.com:interface:axis_rtl:1.0 S_AXIS_A
create_bd_pin -dir I -type clk clk_out1
create_bd_pin -dir I -type rst peripheral_aresetn
create_bd_pin -dir I -from 7 -to 0 din
create_bd_pin -dir I -from 63 -to 0 din1
create_bd_pin -dir O -from 15 -to 0 read_count

create_bd_cell -type ip -vlnv pavel-demin:user:port_slicer:1.0 slice_0
set_property -dict {CONFIG.DIN_FROM 0 CONFIG.DIN_TO 0 CONFIG.DIN_WIDTH 8} [get_bd_cells slice_0]
create_bd_cell -type ip -vlnv pavel-demin:user:port_slicer:1.0 slice_1
set_property -dict {CONFIG.DIN_FROM 39 CONFIG.DIN_TO 0 CONFIG.DIN_WIDTH 64} [get_bd_cells slice_1]
create_bd_cell -type ip -vlnv pavel-demin:user:port_slicer:1.0 slice_2
set_property -dict {CONFIG.DIN_FROM 63 CONFIG.DIN_TO 48 CONFIG.DIN_WIDTH 64} [get_bd_cells slice_2]
create_bd_cell -type ip -vlnv pavel-demin:user:axis_constant:1.0 phase_0
set_property -dict {CONFIG.AXIS_TDATA_WIDTH 40} [get_bd_cells phase_0]
create_bd_cell -type ip -vlnv xilinx.com:ip:dds_compiler:6.0 dds_0
set_property -dict [list \
  CONFIG.DDS_Clock_Rate 122.88 \
  CONFIG.DSP48_Use Minimal \
  CONFIG.Frequency_Resolution 0.2 \
  CONFIG.Has_Phase_Out false \
  CONFIG.Negative_Sine true \
  CONFIG.Output_Width 24 \
  CONFIG.Phase_Increment Streaming \
  CONFIG.Phase_Width 30 \
  CONFIG.Resync true \
  CONFIG.Spurious_Free_Dynamic_Range 138 \
] [get_bd_cells dds_0]
create_bd_cell -type ip -vlnv pavel-demin:user:axis_lfsr:1.0 lfsr_0
create_bd_cell -type ip -vlnv xilinx.com:ip:cmpy:6.0 mult_0
set_property -dict [list \
  CONFIG.APortWidth 14 \
  CONFIG.BPortWidth 24 \
  CONFIG.OutputWidth 26 \
  CONFIG.RoundMode Random_Rounding \
] [get_bd_cells mult_0]
create_bd_cell -type ip -vlnv xilinx.com:ip:axis_broadcaster:1.1 bcast_0
set_property -dict [list \
  CONFIG.HAS_TKEEP 0 \
  CONFIG.HAS_TLAST 0 \
  CONFIG.HAS_TREADY 0 \
  CONFIG.HAS_TSTRB 0 \
  CONFIG.M00_TDATA_REMAP {tdata[23:0]} \
  CONFIG.M01_TDATA_REMAP {tdata[55:32]} \
  CONFIG.M_TDATA_NUM_BYTES 3 \
  CONFIG.M_TUSER_WIDTH 0 \
  CONFIG.S_TDATA_NUM_BYTES 8 \
  CONFIG.S_TUSER_WIDTH 0 \
  CONFIG.TDEST_WIDTH 0 \
  CONFIG.TID_WIDTH 0 \
] [get_bd_cells bcast_0]
create_bd_cell -type ip -vlnv pavel-demin:user:axis_variable:1.0 rate_0
set_property -dict {CONFIG.AXIS_TDATA_WIDTH 16} [get_bd_cells rate_0]
create_bd_cell -type ip -vlnv pavel-demin:user:axis_variable:1.0 rate_1
set_property -dict {CONFIG.AXIS_TDATA_WIDTH 16} [get_bd_cells rate_1]
create_bd_cell -type ip -vlnv xilinx.com:ip:cic_compiler:4.0 cic_0
set_property -dict [list \
  CONFIG.Clock_Frequency 122.88 \
  CONFIG.Filter_Type Decimation \
  CONFIG.Fixed_Or_Initial_Rate 640 \
  CONFIG.HAS_ARESETN true \
  CONFIG.Input_Data_Width 24 \
  CONFIG.Input_Sample_Frequency 122.88 \
  CONFIG.Maximum_Rate 8192 \
  CONFIG.Minimum_Rate 40 \
  CONFIG.Number_Of_Stages 6 \
  CONFIG.Output_Data_Width 32 \
  CONFIG.Quantization Truncation \
  CONFIG.Sample_Rate_Changes Programmable \
  CONFIG.Use_Xtreme_DSP_Slice false \
] [get_bd_cells cic_0]
create_bd_cell -type ip -vlnv xilinx.com:ip:cic_compiler:4.0 cic_1
set_property -dict [list \
  CONFIG.Clock_Frequency 122.88 \
  CONFIG.Filter_Type Decimation \
  CONFIG.Fixed_Or_Initial_Rate 640 \
  CONFIG.HAS_ARESETN true \
  CONFIG.Input_Data_Width 24 \
  CONFIG.Input_Sample_Frequency 122.88 \
  CONFIG.Maximum_Rate 8192 \
  CONFIG.Minimum_Rate 40 \
  CONFIG.Number_Of_Stages 6 \
  CONFIG.Output_Data_Width 32 \
  CONFIG.Quantization Truncation \
  CONFIG.Sample_Rate_Changes Programmable \
  CONFIG.Use_Xtreme_DSP_Slice false \
] [get_bd_cells cic_1]
create_bd_cell -type ip -vlnv xilinx.com:ip:axis_combiner:1.1 comb_0
set_property -dict {CONFIG.TDATA_NUM_BYTES 4} [get_bd_cells comb_0]
create_bd_cell -type ip -vlnv xilinx.com:ip:axis_dwidth_converter:1.1 conv_0
set_property -dict {CONFIG.M_TDATA_NUM_BYTES 4 CONFIG.S_TDATA_NUM_BYTES 8} [get_bd_cells conv_0]
create_bd_cell -type ip -vlnv xilinx.com:ip:fir_compiler:7.2 fir_0
set_property -dict [list \
  CONFIG.BestPrecision true \
  CONFIG.Clock_Frequency 122.88 \
  CONFIG.CoefficientVector {['-1.6474608535e-08, -4.7302195930e-08, -7.8619468076e-10, 3.0921189871e-08, 1.8608837232e-08, 3.2734022251e-08, -6.2813438189e-09, -1.5221363991e-07, -8.3032953559e-08, 3.1439829734e-07,', '3.0552900504e-07, -4.7396324870e-07, -7.1323740619e-07, 5.4707476786e-07, 1.3341171590e-06, -4.1393271599e-07, -2.1496782582e-06, -6.7769353338e-08, 3.0742601185e-06, 1.0366765715e-06,', '-3.9428070248e-06, -2.5909585490e-06, 4.5135845246e-06, 4.7460225319e-06, -4.4910558070e-06, -7.3953978786e-06, 3.5707408445e-06, 1.0285546038e-05, -1.5032224453e-06, -1.3015815434e-05,', '-1.8313444384e-06, 1.5072320650e-05, 6.3521132941e-06, -1.5899576427e-05, -1.1727813184e-05, 1.5005323291e-05, 1.7365093303e-05, -1.2089910213e-05, -2.2458022005e-05, 7.1673633916e-06,', '2.6093058018e-05, -6.6389116544e-07, -2.7418691729e-05, -6.5473442360e-06, 2.5854600003e-05, 1.3198330110e-05, -2.1309361735e-05, -1.7782206252e-05, 1.4361810624e-05, 1.8811515648e-05,', '-6.3566406461e-06, -1.5155979368e-05, -6.3247080943e-07, 6.4130448230e-06, 4.0040582068e-06, 6.7546397959e-06, -1.0026074055e-06, -2.2393312940e-05, -1.0760842920e-05, 3.7217184434e-05,', '3.2690283793e-05, -4.6839875203e-05, -6.4629245773e-05, 4.6239001154e-05, 1.0436232686e-04, -3.0525157948e-05, -1.4740012610e-04, -4.1219698477e-06, 1.8711256488e-04, 5.9452347683e-05,', '-2.1528991520e-04, -1.3425249804e-04, 2.2313567651e-04, 2.2375017156e-04, -2.0262013024e-04, -3.1950057315e-04, 1.4803738125e-04, 4.0989148374e-04, -5.7537086900e-05, -4.8132818219e-04,', '-6.5649818729e-05, 5.2004965910e-04, 2.1257912313e-04, -5.1442095551e-04, -3.6885882761e-04, 4.5729416912e-04, 5.1576895071e-04, -3.4835026230e-04, -6.3263165645e-04, 1.9558527632e-04,', '6.9991497630e-04, -1.5808526144e-05, -7.0293422773e-04, -1.6629328762e-04, 6.3560456533e-04, 3.2068673279e-04, -5.0363032844e-04, -4.1607263761e-04, 3.2646656336e-04, 4.2520826054e-04,', '-1.3744582074e-04, -3.3090412765e-04, -1.8384678041e-05, 1.3189799213e-04, 8.8910161182e-05, 1.5233898500e-04, -2.1947620222e-05, -4.7890099404e-04, -2.2611987722e-04, 7.8125561143e-04,', '6.8011510442e-04, -9.7341268920e-04, -1.3369440637e-03, 9.5707198274e-04, 2.1574180007e-03, -6.3274475096e-04, -3.0612079709e-03, -8.6312096489e-05, 3.9259517547e-03, 1.2584739205e-03,', '-4.5913883984e-03, -2.8979884036e-03, 4.8688805659e-03, 4.9608225128e-03, -4.5560763256e-03, -7.3338396684e-03, 3.4557999231e-03, 9.8287225977e-03, -1.3976559014e-03, -1.2181437284e-02,', '-1.7396234513e-03, 1.4056850557e-02, 6.0061144608e-03, -1.5059808596e-02, -1.1365595088e-02, 1.4742813384e-02, 1.7680205017e-02, -1.2613964567e-02, -2.4703438754e-02, 8.1283099644e-03,', '3.2073997143e-02, -6.4577008839e-04, -3.9302054798e-02, -1.0686996220e-02, 4.5719765638e-02, 2.7237877738e-02, -5.0304069016e-02, -5.1693673194e-02, 5.1004633533e-02, 9.0534093654e-02,', '-4.1604028747e-02, -1.6368908068e-01, -1.0763878172e-02, 3.5633171189e-01, 5.5470627800e-01, 3.5633171189e-01, -1.0763878172e-02, -1.6368908068e-01, -4.1604028747e-02, 9.0534093654e-02,', '5.1004633533e-02, -5.1693673194e-02, -5.0304069016e-02, 2.7237877738e-02, 4.5719765638e-02, -1.0686996220e-02, -3.9302054798e-02, -6.4577008839e-04, 3.2073997143e-02, 8.1283099644e-03,', '-2.4703438754e-02, -1.2613964567e-02, 1.7680205017e-02, 1.4742813384e-02, -1.1365595088e-02, -1.5059808596e-02, 6.0061144608e-03, 1.4056850557e-02, -1.7396234513e-03, -1.2181437284e-02,', '-1.3976559014e-03, 9.8287225977e-03, 3.4557999231e-03, -7.3338396684e-03, -4.5560763256e-03, 4.9608225128e-03, 4.8688805659e-03, -2.8979884036e-03, -4.5913883984e-03, 1.2584739205e-03,', '3.9259517547e-03, -8.6312096489e-05, -3.0612079709e-03, -6.3274475096e-04, 2.1574180007e-03, 9.5707198274e-04, -1.3369440637e-03, -9.7341268920e-04, 6.8011510442e-04, 7.8125561143e-04,', '-2.2611987722e-04, -4.7890099404e-04, -2.1947620222e-05, 1.5233898500e-04, 8.8910161182e-05, 1.3189799213e-04, -1.8384678041e-05, -3.3090412765e-04, -1.3744582074e-04, 4.2520826054e-04,', '3.2646656336e-04, -4.1607263761e-04, -5.0363032844e-04, 3.2068673279e-04, 6.3560456533e-04, -1.6629328762e-04, -7.0293422773e-04, -1.5808526144e-05, 6.9991497630e-04, 1.9558527632e-04,', '-6.3263165645e-04, -3.4835026230e-04, 5.1576895071e-04, 4.5729416912e-04, -3.6885882761e-04, -5.1442095551e-04, 2.1257912313e-04, 5.2004965910e-04, -6.5649818729e-05, -4.8132818219e-04,', '-5.7537086900e-05, 4.0989148374e-04, 1.4803738125e-04, -3.1950057315e-04, -2.0262013024e-04, 2.2375017156e-04, 2.2313567651e-04, -1.3425249804e-04, -2.1528991520e-04, 5.9452347683e-05,', '1.8711256488e-04, -4.1219698477e-06, -1.4740012610e-04, -3.0525157948e-05, 1.0436232686e-04, 4.6239001154e-05, -6.4629245773e-05, -4.6839875203e-05, 3.2690283793e-05, 3.7217184434e-05,', '-1.0760842920e-05, -2.2393312940e-05, -1.0026074055e-06, 6.7546397959e-06, 4.0040582068e-06, 6.4130448230e-06, -6.3247080943e-07, -1.5155979368e-05, -6.3566406461e-06, 1.8811515648e-05,', '1.4361810624e-05, -1.7782206252e-05, -2.1309361735e-05, 1.3198330110e-05, 2.5854600003e-05, -6.5473442360e-06, -2.7418691729e-05, -6.6389116544e-07, 2.6093058018e-05, 7.1673633916e-06,', '-2.2458022005e-05, -1.2089910213e-05, 1.7365093303e-05, 1.5005323291e-05, -1.1727813184e-05, -1.5899576427e-05, 6.3521132941e-06, 1.5072320650e-05, -1.8313444384e-06, -1.3015815434e-05,', '-1.5032224453e-06, 1.0285546038e-05, 3.5707408445e-06, -7.3953978786e-06, -4.4910558070e-06, 4.7460225319e-06, 4.5135845246e-06, -2.5909585490e-06, -3.9428070248e-06, 1.0366765715e-06,', '3.0742601185e-06, -6.7769353338e-08, -2.1496782582e-06, -4.1393271599e-07, 1.3341171590e-06, 5.4707476786e-07, -7.1323740619e-07, -4.7396324870e-07, 3.0552900504e-07, 3.1439829734e-07,', '-8.3032953559e-08, -1.5221363991e-07, -6.2813438189e-09, 3.2734022251e-08, 1.8608837232e-08, 3.0921189871e-08, -7.8619468076e-10, -4.7302195930e-08, -1.6474608535e-08']} \
  CONFIG.Coefficient_Width 24 \
  CONFIG.Data_Width 32 \
  CONFIG.Decimation_Rate 2 \
  CONFIG.Filter_Type Decimation \
  CONFIG.Has_ARESETn true \
  CONFIG.Number_Channels 2 \
  CONFIG.Number_Paths 1 \
  CONFIG.Output_Rounding_Mode Convergent_Rounding_to_Even \
  CONFIG.Output_Width 25 \
  CONFIG.Quantization Quantize_Only \
  CONFIG.Sample_Frequency 3.072 \
] [get_bd_cells fir_0]
create_bd_cell -type ip -vlnv xilinx.com:ip:axis_subset_converter:1.1 subset_0
set_property -dict [list \
  CONFIG.M_HAS_TKEEP 0 \
  CONFIG.M_HAS_TLAST 0 \
  CONFIG.M_HAS_TREADY 0 \
  CONFIG.M_HAS_TSTRB 0 \
  CONFIG.M_TDATA_NUM_BYTES 3 \
  CONFIG.M_TDEST_WIDTH 0 \
  CONFIG.M_TID_WIDTH 0 \
  CONFIG.M_TUSER_WIDTH 0 \
  CONFIG.S_HAS_TKEEP 0 \
  CONFIG.S_HAS_TLAST 0 \
  CONFIG.S_HAS_TREADY 0 \
  CONFIG.S_HAS_TSTRB 0 \
  CONFIG.S_TDATA_NUM_BYTES 4 \
  CONFIG.S_TDEST_WIDTH 0 \
  CONFIG.S_TID_WIDTH 0 \
  CONFIG.S_TUSER_WIDTH 0 \
  CONFIG.TDATA_REMAP {tdata[23:0]} \
] [get_bd_cells subset_0]
create_bd_cell -type ip -vlnv xilinx.com:ip:floating_point:7.1 fp_0
set_property -dict [list \
  CONFIG.A_Precision_Type Custom \
  CONFIG.C_A_Exponent_Width 2 \
  CONFIG.C_A_Fraction_Width 22 \
  CONFIG.Has_ARESETn true \
  CONFIG.Operation_Type Fixed_to_float \
  CONFIG.Result_Precision_Type Single \
] [get_bd_cells fp_0]
create_bd_cell -type ip -vlnv xilinx.com:ip:axis_dwidth_converter:1.1 conv_1
set_property -dict {CONFIG.M_TDATA_NUM_BYTES 8 CONFIG.S_TDATA_NUM_BYTES 4} [get_bd_cells conv_1]
create_bd_cell -type ip -vlnv pavel-demin:user:axis_fifo:1.0 fifo_0
set_property -dict [list \
  CONFIG.ALWAYS_READY TRUE \
  CONFIG.M_AXIS_TDATA_WIDTH 32 \
  CONFIG.S_AXIS_TDATA_WIDTH 64 \
  CONFIG.WRITE_DEPTH 4096 \
] [get_bd_cells fifo_0]
